# EAGLE design BB2LLOAD_SNES (EAGLE 6.6.0)
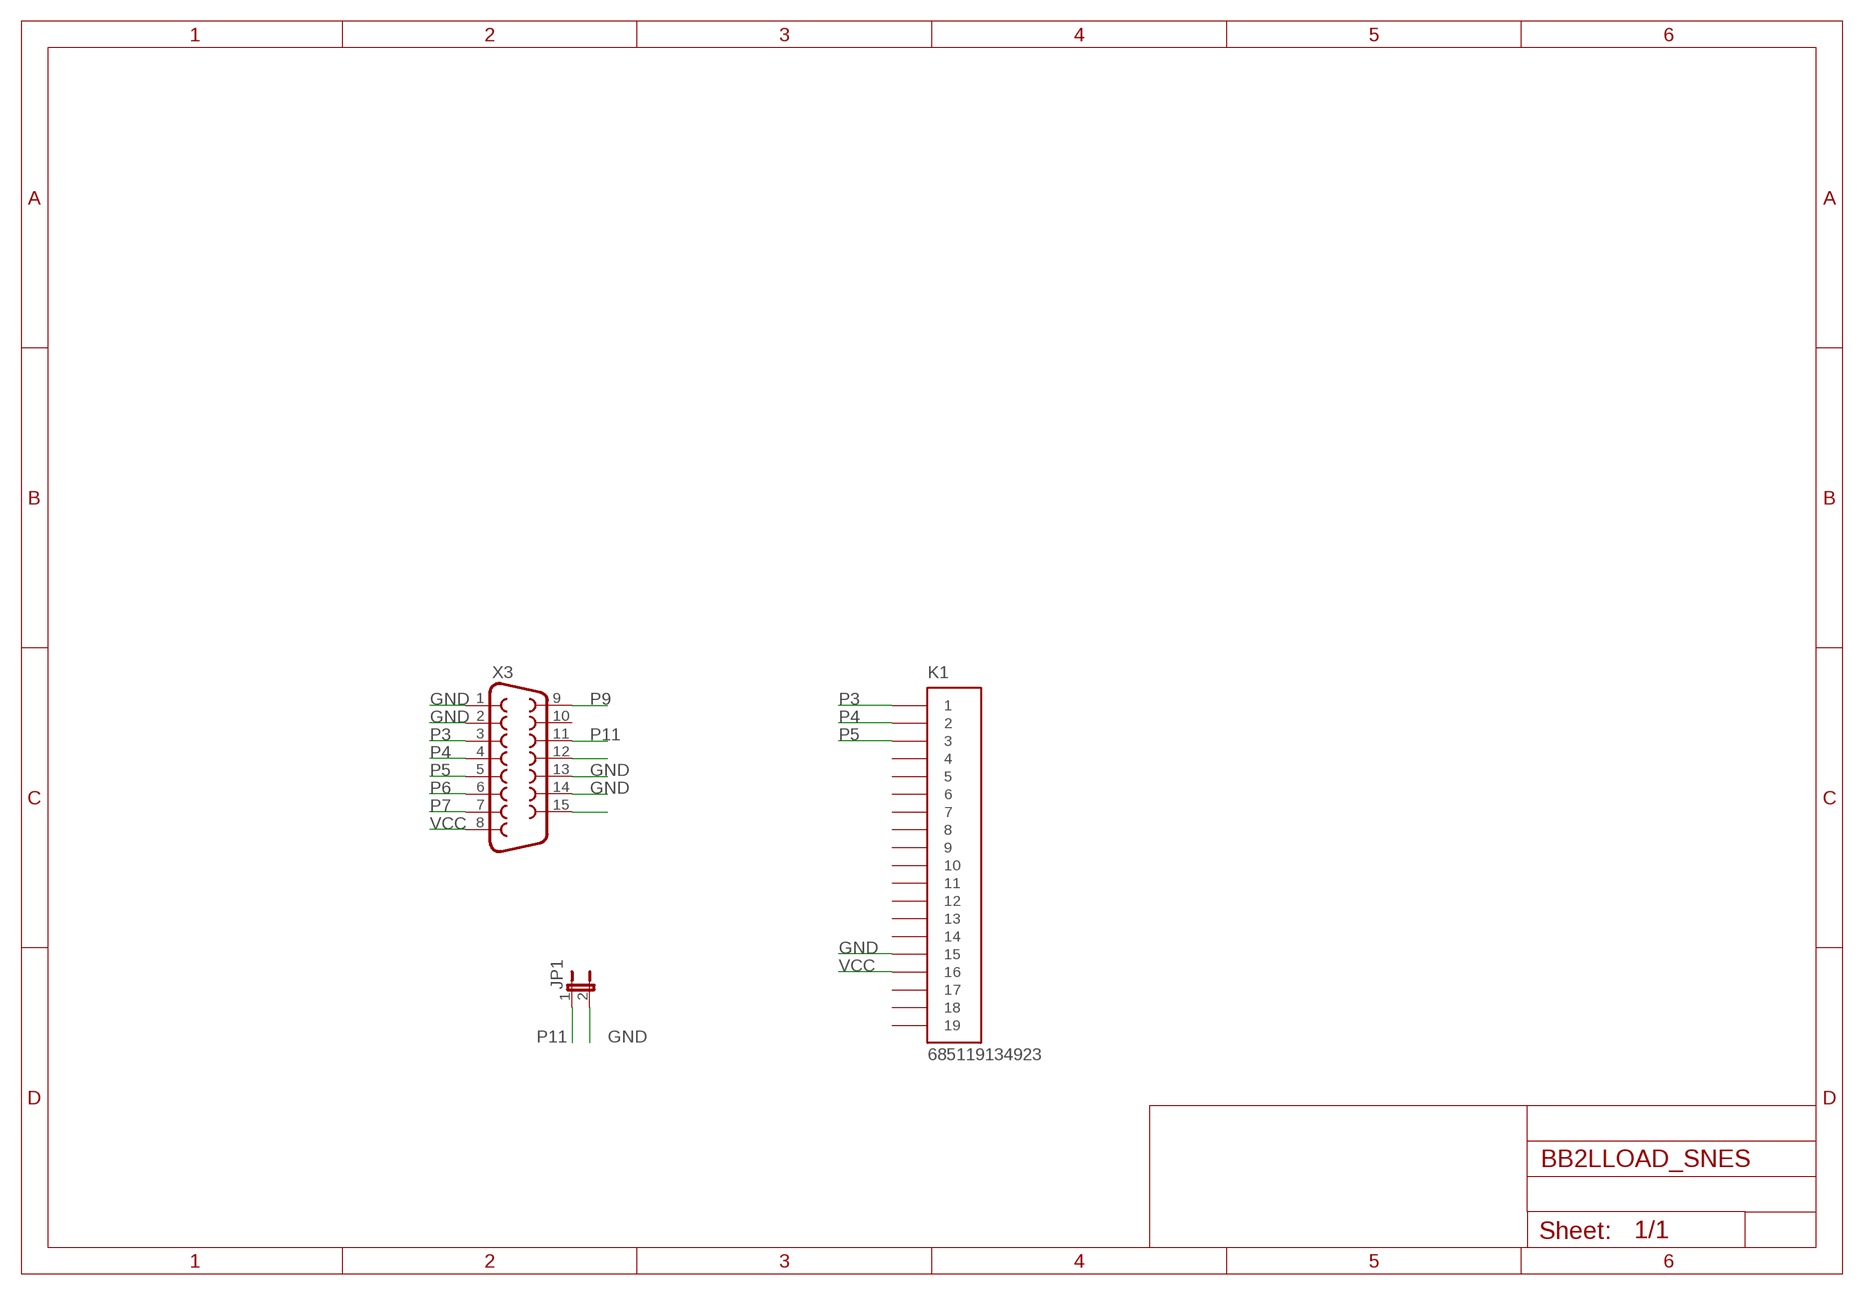
[diagram p0: schematic, sheet 1]

## Parts
JP1  JP1E  [JP1]
K1  685119134923  [685119134923]
X3  F15HP  [F15HP]

## Nets
GND: JP1.2 K1.15 X3.1 X3.2 X3.13 X3.14
N$1: X3.12
N$4: X3.15
P3: K1.1 X3.3
P4: K1.2 X3.4
P5: K1.3 X3.5
P6: X3.6
P7: X3.7
P9: X3.9
P11: JP1.1 X3.11
VCC: K1.16 X3.8
Unconnected: K1.4 K1.5 K1.6 K1.7 K1.8 K1.9 K1.10 K1.11 K1.12 K1.13 K1.14 K1.17 K1.18 K1.19 X3.10

## Library data of the parts
JP1 = jumper:JP1E: JUMPER
K1 = wuerth:685119134923: WR-COM SMT Horizontal HDMI, 19 pins
X3 = con-subd:F15: SUB-D; OC_FARNELL: unknown; OC_NEWARK: unknown

## Board
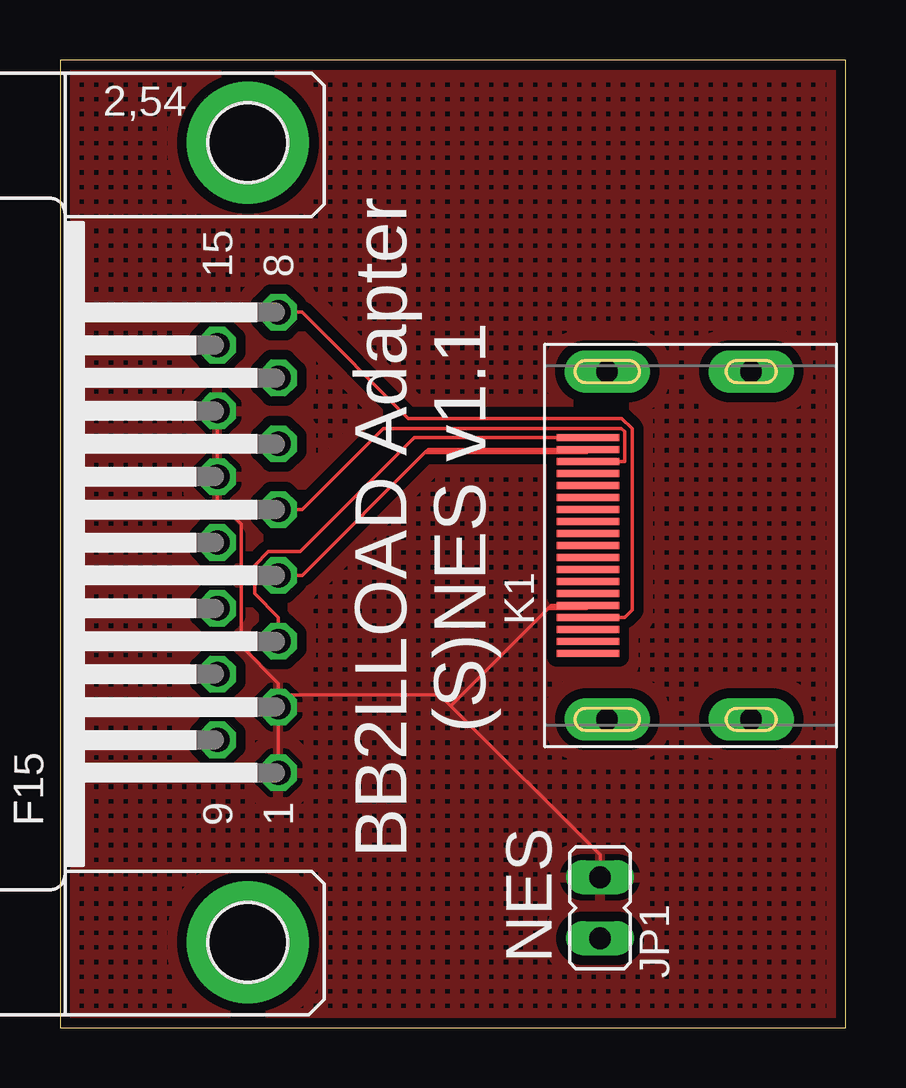
[diagram p1: board, top side]
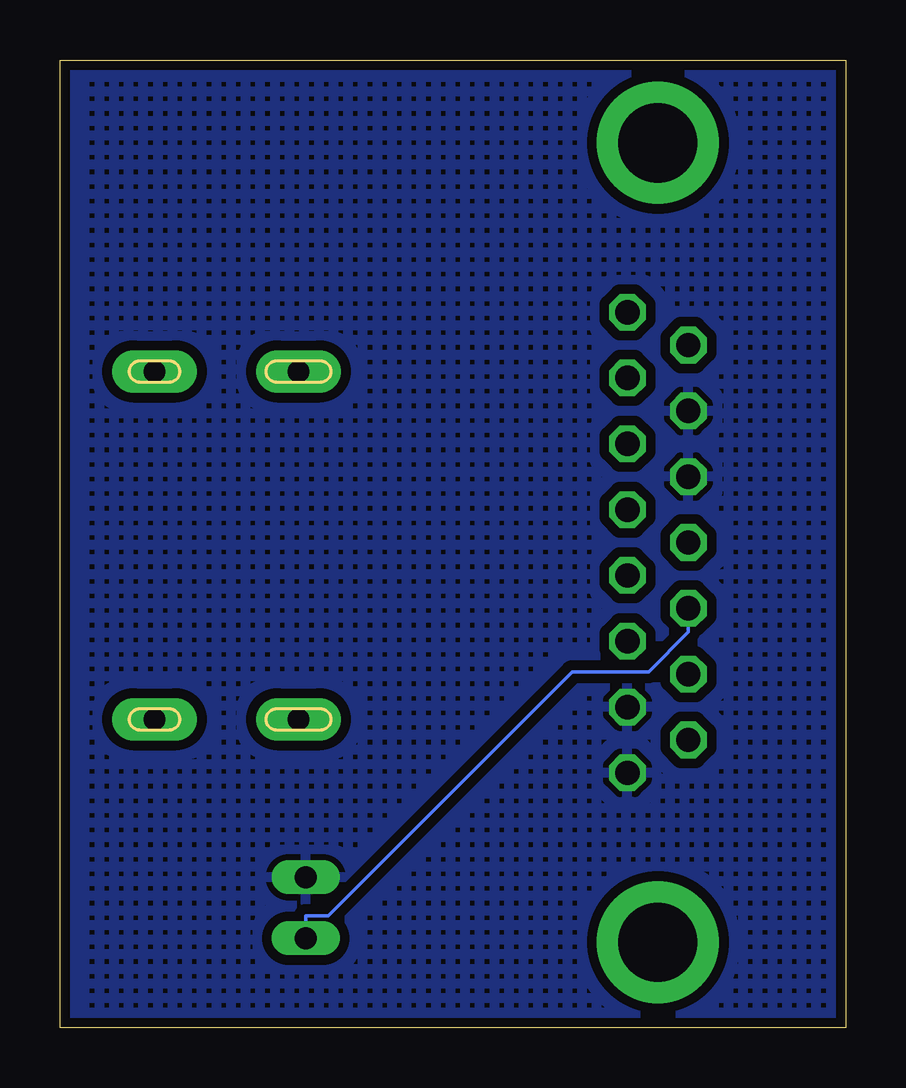
[diagram p2: board, bottom side, seen from below]

Size 32.74 x 40.34 mm. Coordinates in mm from the lower left corner, seen from the top.
Outline: 0,40.34 0,0 32.74,0 32.74,40.34 0,40.34
Copper layers (1*16): Top 0.035mm / dielectric 1.5mm / Bottom 0.035mm
Design rules "SeeedStudio_2layer_DRU_no_angle_20140221": minimum track width 6mil, minimum drill 12mil, track to track 6mil, track to pad 6mil, pad to pad 6mil, via to via 6mil, smd to smd 0mil, copper to edge 10mil, drill to drill 10mil, minimum pad ring 10mil, minimum via ring 6mil, stop-mask expansion 2mil, vias tented up to drill 100mil, thermal gap 10mil

### Footprints (pad centres in the part's own frame; a part is rotated, then mirrored left to right if it is on the bottom)
JP1 = drill 0.914 long: 1 0,-1.27; 2 0,1.27
685119134923 = smd 0.28 x 2.6: 1 4.5,0; 2 4,0; 3 3.5,0; 4 3,0; 5 2.5,0; 6 2,0; 7 1.5,0; 8 1,0; 9 0.5,0; 10 0,0; 11 -0.5,0; 12 -1,0; 13 -1.5,0; 14 -2,0; 15 -2.5,0; 16 -3,0; 17 -3.5,0; 18 -4,0; 19 -4.5,0 | drill 0.9 pad 1.778 long: Z1 -7.25,-0.8; Z2 -7.25,-6.8; Z3 7.25,-6.8; Z4 7.25,-0.8
F15HP = drill 1.016 octagon: 1 -9.601,-1.27; 2 -6.858,-1.27; 3 -4.115,-1.27; 4 -1.372,-1.27; 5 1.372,-1.27; 6 4.115,-1.27; 7 6.858,-1.27; 8 9.601,-1.27; 9 -8.23,1.27; 10 -5.486,1.27; 11 -2.743,1.27; 12 0,1.27; 13 2.743,1.27; 14 5.486,1.27; 15 8.23,1.27 | drill 3.302 pad 5.08: G1 -16.662,0; G2 16.662,0

### Placement (x,y rotation side)
JP1  22.5,5 0 top
K1  22,20.1 90 top
X3  7.83,20.22 90 top

### Tracks (layer width: path | path; a pad name or v marks a point on that pad's centre or on a via)
GND
  Top 0.152: 16.29,13.42 22.5,7.21 JP1.2 | 9.1,13.86 15.85,13.86 16.29,13.42 | 20.33,17.46 20.47,17.6 K1.15 21.95,17.48 20.32,17.48 20.33,17.46 | 20.33,17.46 16.29,13.42 | 9.1,13.86 9.1,14.35 7.55,15.9 7.55,20.98 6.56,21.97 X3.13 X3.14 | 9.1,13.86 X3.2 X3.1
  pour Top (isolate 0.406, hatched): 0.05,40.25 32.9,40.25 32.9,0 0.05,0
  pour Bottom (isolate 0.406, hatched): 0,40.3 32.95,40.3 32.95,0 0,0
P3
  Top 0.152: X3.3 9.1,17.1 8.11,18.09 8.11,19.26 8.68,19.84 10.01,19.84 14.77,24.6 21.95,24.6 | 21.95,24.6 K1.1 21.95,24.59 21.95,24.6
P4
  Top 0.152: X3.4 10.09,18.85 15.23,23.99 | 15.23,23.99 15.34,24.1 K1.2 21.95,23.98 15.24,23.98 15.23,23.99
P5
  Top 0.152: K1.3 23.53,23.6 23.53,24.84 23.39,24.98 13.47,24.98 10.09,21.59 X3.5 | K1.3 21.95,23.57 K1.3
P11
  Bottom 0.152: JP1.1 22.5,4.67 21.56,4.67 11.4,14.83 8.21,14.83 6.56,16.49 X3.11
VCC
  Top 0.152: K1.16 23.53,17.1 23.83,17.41 23.83,24.97 23.4,25.4 14.52,25.4 10.09,29.82 X3.8 | K1.16 21.95,17.07 K1.16

### Text on the board
tPlace: BB2LLOAD Adapter / (S)NES v1.1 | NES